# EAGLE schematic circuit (EAGLE 6.6.0)
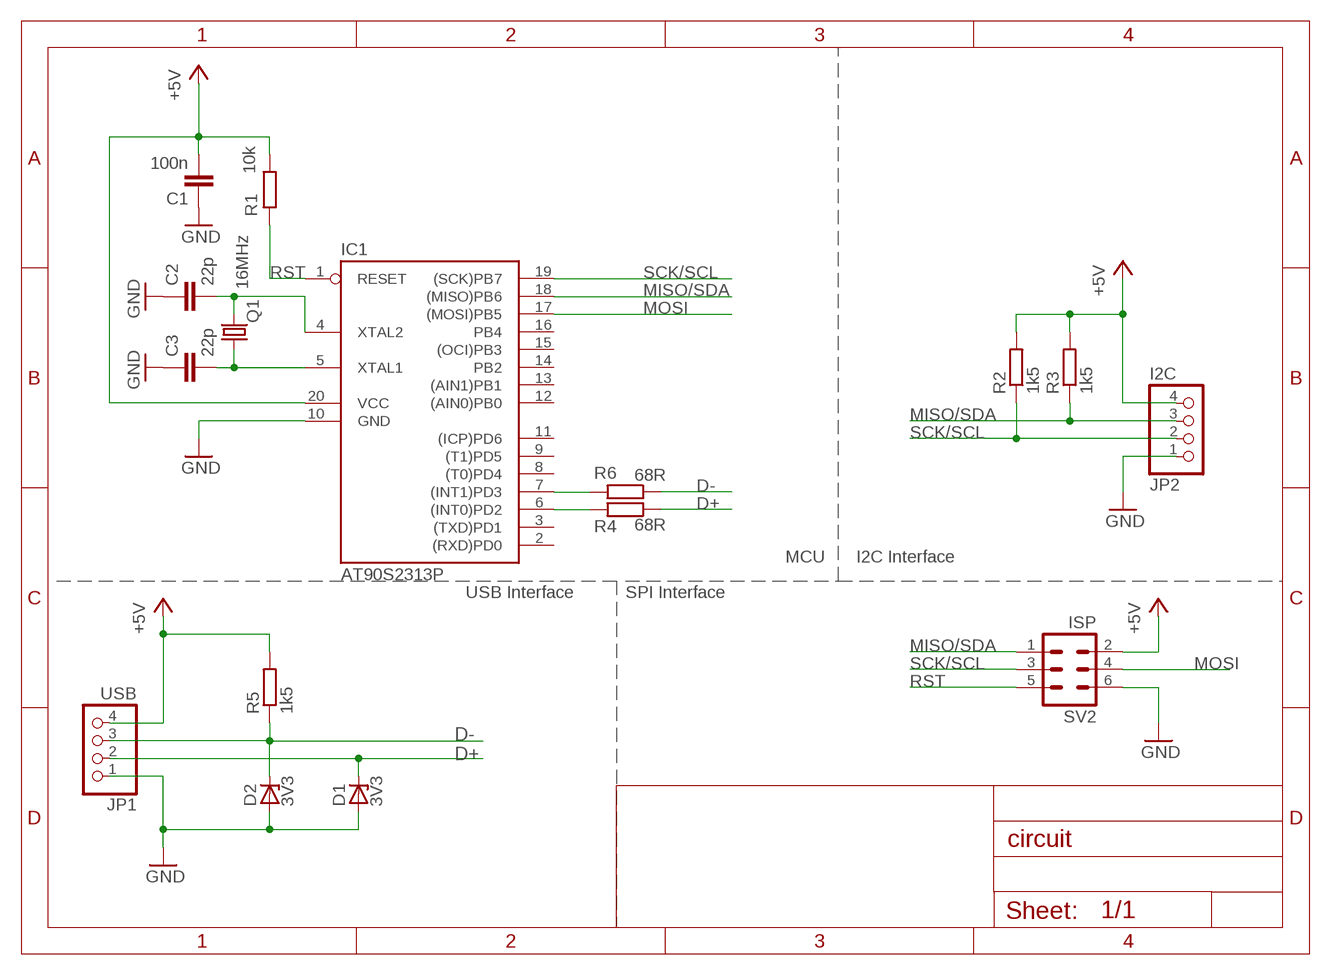
[diagram p0: schematic, sheet 1]

## Parts
C1  100n  C-EUC0805  [C0805]
C2  22p  C-EUC0805  [C0805]
C3  22p  C-EUC0805  [C0805]
D1  3V3  ZENER-DIODEDO34-7  [DO34Z7]
D2  3V3  ZENER-DIODEDO34-7  [DO34Z7]
IC1  AT90S2313P  [DIL20]
JP1  USB  PINHD-1X4  [1X04]
JP2  I2C  PINHD-1X4  [1X04]
Q1  16MHz  CRYTALHC49S  [HC49/S]
R1  10k  R-EU_0207/10  [0207/10]
R2  1k5  R-EU_0207/10  [0207/10]
R3  1k5  R-EU_0207/10  [0207/10]
R4  68R  R-EU_0207/10  [0207/10]
R5  1k5  R-EU_0207/10  [0207/10]
R6  68R  R-EU_0207/10  [0207/10]
SV2  ISP  ML6  [ML6]

## Nets
+5V: C1.2 IC1.20(VCC) JP1.4 JP2.4 R1.2 R2.2 R3.2 R5.2 SV2.2
AVRD+: IC1.6((INT0)PD2) R4.2
AVRD-: IC1.7((INT1)PD3) R6.2
D+: D1.C JP1.2 R4.1
D-: D2.C JP1.3 R5.1 R6.1
GND: C1.1 C2.1 C3.1 D1.A D2.A IC1.10(GND) JP1.1 JP2.1 SV2.6
MISO/SDA: IC1.18((MISO)PB6) JP2.3 R3.1 SV2.1
MOSI: IC1.17((MOSI)PB5) SV2.4
N$37: C3.2 IC1.5(XTAL1) Q1.1
N$38: C2.2 IC1.4(XTAL2) Q1.2
RST: IC1.1(RESET) R1.1 SV2.5
SCK/SCL: IC1.19((SCK)PB7) JP2.2 R2.1 SV2.3
Unconnected: IC1.2((RXD)PD0) IC1.3((TXD)PD1) IC1.8((T0)PD4) IC1.9((T1)PD5) IC1.11((ICP)PD6) IC1.12((AIN0)PB0) IC1.13((AIN1)PB1) IC1.14(PB2) IC1.15((OCI)PB3) IC1.16(PB4)

## Notes on the sheet
- MCU | I2C Interface
- USB Interface | SPI Interface

## Library data of the parts
C1-C3 = rcl:C-EU: CAPACITOR, European symbol
D1 D2 = diode:ZENER-DIODE: Z-Diode
IC1 = atmel:AT90S2313: MICROCONTROLLER 2 Kbytes FLASH 128 bytes SRAM 128 bytes EEPROM UART
JP1 JP2 = pinhead:PINHD-1X4: PIN HEADER
Q1 = crystal:CRYTAL: CRYSTAL
R1-R6 = rcl:R-EU_: RESISTOR, European symbol
SV2 = con-harting-ml:ML6: HARTING; OC_FARNELL: unknown; OC_NEWARK: unknown